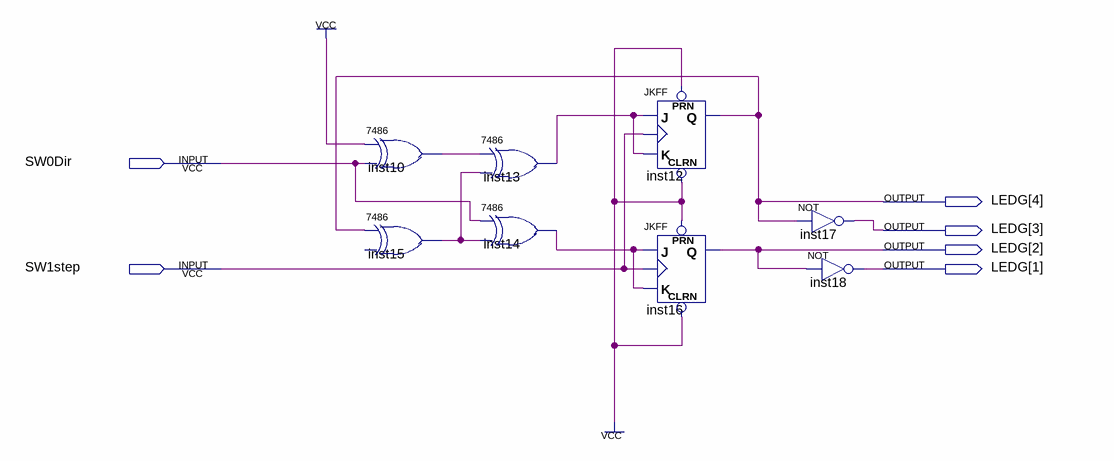
[diagram p0: schematic sheet]
// Quartus schematic jk.bdf as structural Verilog: 8 symbols, 6 pins
module jk (
  input  SW0Dir,
  input  SW1step,
  output [4:1] LEDG
);

  wire inst10_1, inst13_1, inst14_1, inst15_1;

  \7486  inst10 (.\2 (1'b1), .\3 (SW0Dir), .\1 (inst10_1));
  \7486  inst15 (.\2 (LEDG[4]), .\1 (inst15_1));  // open: 3
  \7486  inst13 (.\2 (inst10_1), .\3 (inst15_1), .\1 (inst13_1));
  \7486  inst14 (.\2 (SW0Dir), .\3 (inst15_1), .\1 (inst14_1));
  JKFF inst12 (.PRN(1'b1), .CLRN(1'b1), .K(inst13_1), .J(inst13_1), .CLK(SW1step), .Q(LEDG[4]));
  JKFF inst16 (.PRN(1'b1), .CLRN(1'b1), .K(inst14_1), .J(inst14_1), .CLK(SW1step), .Q(LEDG[2]));
  not inst17 (LEDG[3], LEDG[4]);
  not inst18 (LEDG[1], LEDG[2]);
endmodule
